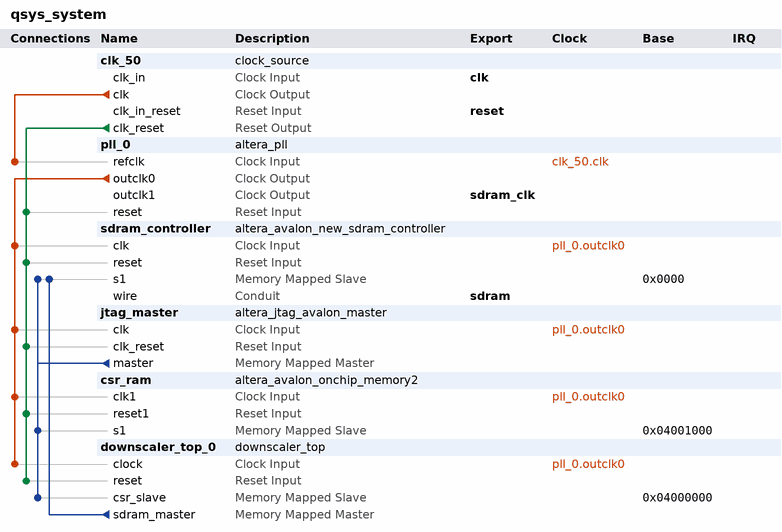
[diagram p0: system contents]
# Platform Designer (Qsys) system qsys_system, Cyclone V 5CSEMA5F31C6
# Parameters at their usual value, and those the tool derives, are not listed.
package require -exact qsys 20.1
create_system qsys_system
set_project_property DEVICE_FAMILY {Cyclone V}
set_project_property DEVICE 5CSEMA5F31C6

add_instance clk_50 clock_source 20.1
set_instance_parameter_value clk_50 clockFrequency 50000000
set_instance_parameter_value clk_50 resetSynchronousEdges DEASSERT

add_instance pll_0 altera_pll 20.1
set_instance_parameter_value pll_0 gui_device_speed_grade 1
set_instance_parameter_value pll_0 gui_number_of_clocks 2
set_instance_parameter_value pll_0 gui_operation_mode normal
set_instance_parameter_value pll_0 gui_output_clock_frequency0 100.0
set_instance_parameter_value pll_0 gui_output_clock_frequency1 100.0
set_instance_parameter_value pll_0 gui_phase_shift1 -3000
set_instance_parameter_value pll_0 gui_pll_mode {Integer-N PLL}
set_instance_parameter_value pll_0 gui_reference_clock_frequency 50.0
set_instance_parameter_value pll_0 gui_use_locked true

add_instance sdram_controller altera_avalon_new_sdram_controller 20.1
set_instance_parameter_value sdram_controller TAC 5.5
set_instance_parameter_value sdram_controller TRCD 20.0
set_instance_parameter_value sdram_controller TRP 20.0
set_instance_parameter_value sdram_controller TWR 20.0
set_instance_parameter_value sdram_controller casLatency 3
set_instance_parameter_value sdram_controller columnWidth 10
set_instance_parameter_value sdram_controller dataWidth 16
set_instance_parameter_value sdram_controller generateSimulationModel false
set_instance_parameter_value sdram_controller model single_Micron_MT48LC4M32B2_7_chip
set_instance_parameter_value sdram_controller numberOfBanks 4
set_instance_parameter_value sdram_controller numberOfChipSelects 1
set_instance_parameter_value sdram_controller powerUpDelay 100.0
set_instance_parameter_value sdram_controller refreshPeriod 15.625
set_instance_parameter_value sdram_controller rowWidth 13

add_instance jtag_master altera_jtag_avalon_master 20.1
set_instance_parameter_value jtag_master USE_PLI 1

add_instance csr_ram altera_avalon_onchip_memory2 20.1
set_instance_parameter_value csr_ram dataWidth 32
set_instance_parameter_value csr_ram dualPort false
set_instance_parameter_value csr_ram initMemContent false
set_instance_parameter_value csr_ram initializationFileName onchip_mem.hex
set_instance_parameter_value csr_ram memorySize 4096

add_instance downscaler_top_0 downscaler_top 1.0
set_instance_parameter_value downscaler_top_0 LANES 4
set_instance_parameter_value downscaler_top_0 Q 8

# connections
add_connection clk_50.clk pll_0.refclk clock
add_connection pll_0.outclk0 csr_ram.clk1 clock
add_connection pll_0.outclk0 downscaler_top_0.clock clock
add_connection pll_0.outclk0 jtag_master.clk clock
add_connection pll_0.outclk0 sdram_controller.clk clock
add_connection clk_50.clk_reset csr_ram.reset1 reset
add_connection clk_50.clk_reset downscaler_top_0.reset reset
add_connection clk_50.clk_reset jtag_master.clk_reset reset
add_connection clk_50.clk_reset pll_0.reset reset
add_connection clk_50.clk_reset sdram_controller.reset reset
add_connection downscaler_top_0.sdram_master sdram_controller.s1 avalon
set_connection_parameter_value downscaler_top_0.sdram_master/sdram_controller.s1 baseAddress 0x0000
add_connection jtag_master.master csr_ram.s1 avalon
set_connection_parameter_value jtag_master.master/csr_ram.s1 baseAddress 0x04001000
add_connection jtag_master.master downscaler_top_0.csr_slave avalon
set_connection_parameter_value jtag_master.master/downscaler_top_0.csr_slave baseAddress 0x04000000
add_connection jtag_master.master sdram_controller.s1 avalon
set_connection_parameter_value jtag_master.master/sdram_controller.s1 baseAddress 0x0000

# exported interfaces
add_interface clk clock sink
set_interface_property clk EXPORT_OF clk_50.clk_in
add_interface reset reset sink
set_interface_property reset EXPORT_OF clk_50.clk_in_reset
add_interface sdram conduit end
set_interface_property sdram EXPORT_OF sdram_controller.wire
add_interface sdram_clk clock source
set_interface_property sdram_clk EXPORT_OF pll_0.outclk1

set_interconnect_requirement {$system} qsys_mm.clockCrossingAdapter HANDSHAKE
set_interconnect_requirement {$system} qsys_mm.enableEccProtection FALSE
set_interconnect_requirement {$system} qsys_mm.insertDefaultSlave FALSE
set_interconnect_requirement {$system} qsys_mm.maxAdditionalLatency 1

save_system qsys_system.qsys
